# Altium schematic sheet [5] LED.SchDoc: LEDs
size A3; SheetNumber: 5; SheetTotal: 7
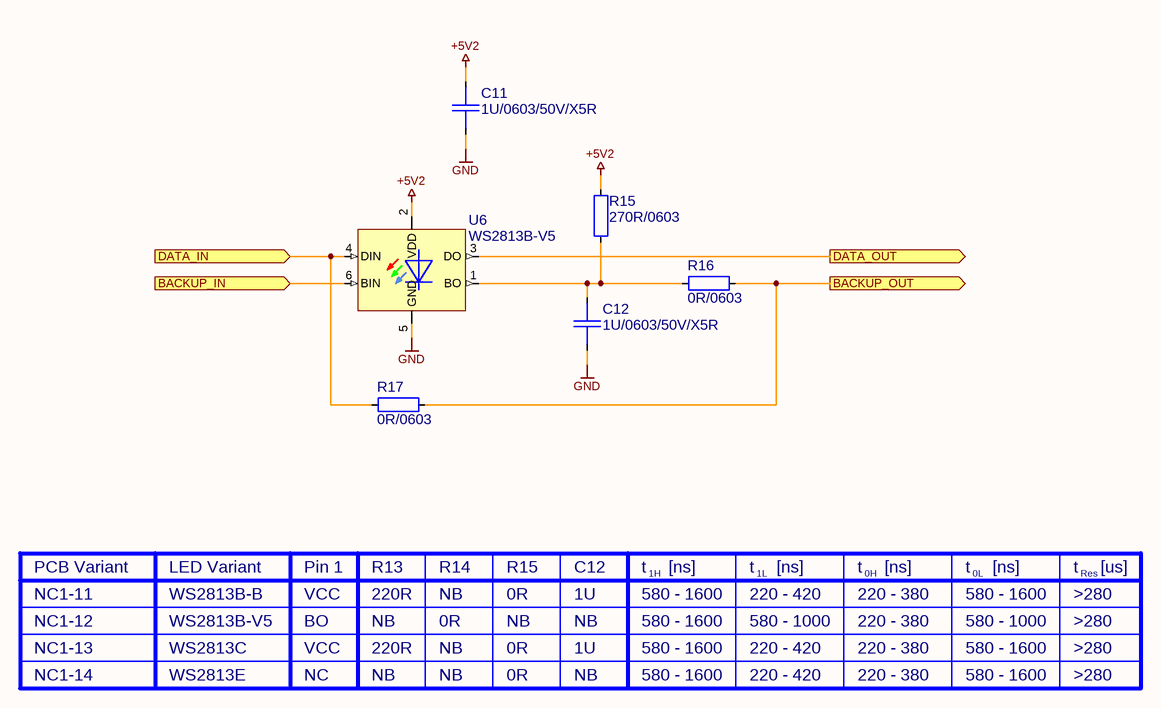
[diagram p0: [5] LED.SchDoc]

## Parts
C11  1U/0603/50V/X5R  [CAP0603_X7R]
C12  1U/0603/50V/X5R  [CAP0603_X7R]
R15  270R/0603  [R0603-0.40-WW]
R16  0R/0603  [R0603-0.40-WW]
R17  0R/0603  [R0603-0.40-WW]
U6  WS2813B-V5  [LEDM5050X165-6-SE]

## Ports
BACKUP_IN (in), BACKUP_OUT (out), DATA_IN (in), DATA_OUT (out)

## Nets
+5V2: C11.1 R15.1 U6.2(VDD)
GND: C11.2 C12.2 U6.5(GND)
BACKUP_IN: U6.6(BIN) ; port BACKUP_IN
BACKUP_OUT: R16.2 R17.2 ; port BACKUP_OUT
DATA_IN: R17.1 U6.4(DIN) ; port DATA_IN
DATA_OUT: U6.3(DO) ; port DATA_OUT
NetC12_1: C12.1 R15.2 R16.1 U6.1(BO)

## Notes on the sheet
- PCB Variant
- LED Variant
- Pin 1
- R13
- R14
- R15
- C12
- t
- 1H
- [ns]
- 1L
- 0H
- 0L
- Res
- [us]
- NC1-12
- NC1-11
- NC1-13
- WS2813B-V5
- WS2813B-B
- WS2813C
- VCC
- BO
- 220R
- NB
- 0R
- 1U
- 580 - 1600
- 220 - 420
- 580 - 1000
- 220 - 380
- >280
- NC1-14
- WS2813E
- NC
- Date:
- Size:
- A3
- Schema:
- Layout:

## Library data of the parts
C11 C12 = 1U/0603/50V/X5R: CAP SM 0603 1.0uF 50V X5R; Manufacturer: GENERIC; Absolute Value: 1E-6; Part Number: 1U/0603/50V/X5R; Package: 603; Value: 1.0uF; Manufacturer Part Number 3: CL10A105KB8NNNC; Supplier 3: LCSC; Supplier Part Number 3: C15849; JLC Type: Basic
R15 = 270R/0603: RES SM 0603 270R; Manufacturer: GENERIC; Manufacturer 1: YAGEO; Manufacturer Part Number 1: RC0603FR-13270RL; Absolute Value: 270; Part Number: 270R/0603; Package: 0603; Value: 270R; HelpURL: https://www.yageo.com/upload/media/product/productsearch/datasheet/rchip/PYu-RC_Group_51_RoHS_L_12.pdf; Supplier 1: Digi-Key; Supplier Part Number 1: 13-RC0603FR-13270RLCT-ND; Manufacturer 2: YAGEO; Manufacturer Part Number 2: RC0603FR-10270RL; Supplier 2: Digi-Key; Supplier Part Number 2: 13-RC0603FR-10270RLCT-ND; Manufacturer 3: UNI-ROYAL(Uniroyal Elec); Manufacturer Part Number 3: 0603WAF2700T5E; Supplier 3: LCSC; Supplier Part Number 3: C22966; JLC Type: Basic
R16 R17 = 0R/0603: RES SM 0603 0R; Manufacturer: GENERIC; Manufacturer 1: YAGEO; Manufacturer Part Number 1: RC0603FR-070RL; Absolute Value: 0; Part Number: 0R/0603; Package: 0603; Value: 0R; HelpURL: https://www.yageo.com/upload/media/product/app/datasheet/rchip/pyu-rc_group_51_rohs_l.pdf; Supplier 1: Digi-Key; Supplier Part Number 1: 311-0.0HRCT-ND; Manufacturer 2: YAGEO; Manufacturer Part Number 2: RC0603FR-130RL; Supplier 2: Digi-Key; Supplier Part Number 2: 13-RC0603FR-130RLCT-ND; Manufacturer 3: UNI-ROYAL(Uniroyal Elec); Manufacturer Part Number 3: 0603WAF0000T5E; Supplier 3: LCSC; Supplier Part Number 3: C21189; JLC Type: Basic
U6 = WS2813B-V5: Intelligent control LED integrated light source with backup Pin; Manufacturer: WorldSemi; Part Number: WS2813B-V5; Package: SMD5050; HelpURL: https://datasheet.lcsc.com/lcsc/2012110135_Worldsemi-WS2813B-V5_C965558.pdf; Manufacturer 3: WorldSemi; Manufacturer Part Number 3: WS2813B-V5; Supplier 3: LCSC; Supplier Part Number 3: C965558; JLC Type: Extended